# Altium schematic sheet esp32.SchDoc
size A4; SheetNumber: 1; SheetTotal: 1
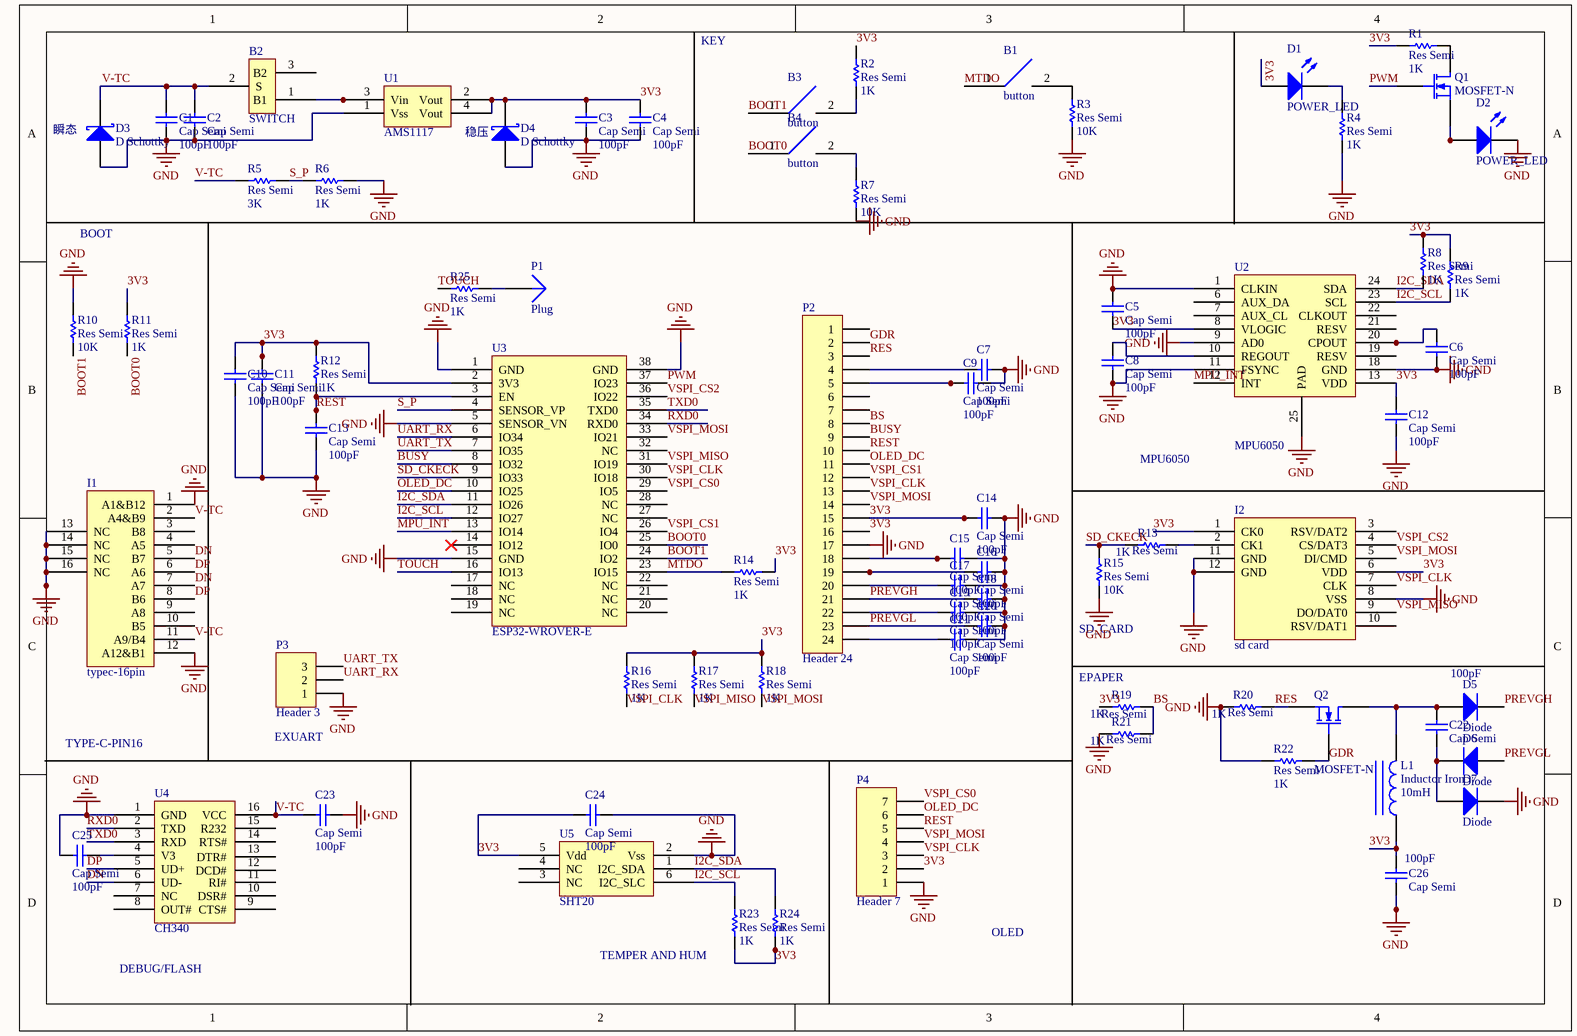
[diagram p0: esp32.SchDoc]

## Parts
B1  button  [BUTTON-BODY(3x6x2.5)]
B2  SWITCH  [switch-3]
B3  button  [BUTTON-BODY(3x6x2.5)]
B4  button  [BUTTON-BODY(3x6x2.5)]
C1  Cap Semi  value 100pF  [1608[0603]]
C2  Cap Semi  value 100pF  [1608[0603]]
C3  Cap Semi  value 100pF  [1608[0603]]
C4  Cap Semi  value 100pF  [1608[0603]]
C5  Cap Semi  value 100pF  [1608[0603]]
C6  Cap Semi  value 100pF  [1608[0603]]
C7  Cap Semi  value 100pF  [1608[0603]]
C8  Cap Semi  value 100pF  [1608[0603]]
C9  Cap Semi  value 100pF  [1608[0603]]
C10  Cap Semi  value 100pF  [1608[0603]]
C11  Cap Semi  value 100pF  [1608[0603]]
C12  Cap Semi  value 100pF  [1608[0603]]
C13  Cap Semi  value 100pF  [1608[0603]]
C14  Cap Semi  value 100pF  [1608[0603]]
C15  Cap Semi  value 100pF  [1608[0603]]
C16  Cap Semi  value 100pF  [1608[0603]]
C17  Cap Semi  value 100pF  [1608[0603]]
C18  Cap Semi  value 100pF  [1608[0603]]
C19  Cap Semi  value 100pF  [1608[0603]]
C20  Cap Semi  value 100pF  [1608[0603]]
C21  Cap Semi  value 100pF  [1608[0603]]
C22  Cap Semi  value 100pF  [1608[0603]]
C23  Cap Semi  value 100pF  [1608[0603]]
C24  Cap Semi  value 100pF  [1608[0603]]
C25  Cap Semi  value 100pF  [1608[0603]]
C26  Cap Semi  value 100pF  [1608[0603]]
D1  POWER_LED  [6-0805_M]
D2  POWER_LED  [6-0805_M]
D3  D Schottky  [TVS-BODY(4.5x3.5)]
D4  D Schottky  [Diode-body(5x2.45)]
D5  Diode  [INDC4532]
D6  Diode  [1812]
D7  Diode  [1812]
I1  typec-16pin  [Type-C-16PIN]
I2  sd card  [TF-Card]
L1  Inductor Iron  value 10mH  [1812]
P1  Plug  [PIN1]
P2  Header 24  [Connector-FPC-0.5*24]
P3  Header 3  [Connector-3.5x3]
P4  Header 7  [HDR1X7]
Q1  MOSFET-N  [SOT23_L]
Q2  MOSFET-N  [SOT23_L]
R1  Res Semi  value 1K  [1608[0603]]
R2  Res Semi  value 1K  [1608[0603]]
R3  Res Semi  value 10K  [1608[0603]]
R4  Res Semi  value 1K  [1608[0603]]
R5  Res Semi  value 3K  [1608[0603]]
R6  Res Semi  value 1K  [1608[0603]]
R7  Res Semi  value 10K  [1608[0603]]
R8  Res Semi  value 1K  [1608[0603]]
R9  Res Semi  value 1K  [1608[0603]]
R10  Res Semi  value 10K  [1608[0603]]
R11  Res Semi  value 1K  [1608[0603]]
R12  Res Semi  value 1K  [1608[0603]]
R13  Res Semi  value 1K  [1608[0603]]
R14  Res Semi  value 1K  [1608[0603]]
R15  Res Semi  value 10K  [1608[0603]]
R16  Res Semi  value 1K  [1608[0603]]
R17  Res Semi  value 1K  [1608[0603]]
R18  Res Semi  value 1K  [1608[0603]]
R19  Res Semi  value 1K  [1608[0603]]
R20  Res Semi  value 1K  [1608[0603]]
R21  Res Semi  value 1K  [1608[0603]]
R22  Res Semi  value 1K  [1608[0603]]
R23  Res Semi  value 1K  [1608[0603]]
R24  Res Semi  value 1K  [1608[0603]]
R25  Res Semi  value 1K  [1608[0603]]
U1  AMS1117  [SOT223_M]
U2  MPU6050  [MPU6050]
U3  ESP32-WROVER-E  [ESP32-WROVER-E]
U4  CH340  [SOP16-SOP127P650X265-16N]
U5  SHT20  [SHT20]

## Nets
GND: C1.1 C2.1 C3.1 C4.1 C5.2 C6.1 C7.1 C8.1 C9.1 C10.1 C11.1 C12.1 C13.1 C14.1 C15.1 C16.1 C17.1 C18.1 C19.1 C20.1 C21.1 C23.1 C24.1 C25.2 C26.1 D2.2(K) D3.1(A) D4.1(A) D7.2(K) I1.1(A1&B12) I1.12(A12&B1) I1.13(NC) I1.14(NC) I1.15(NC) I1.16(NC) I2.8(VSS) I2.11(GND) I2.12(GND) P2.17 P3.1 P4.1 R3.2 R4.2 R6.2 R7.2 R10.1 R15.1 R20.1 R21.1 R22.1 U1.1(Vss) U2.1(CLKIN) U2.9(AD0) U2.11(FSYNC) U2.18(GND) U2.25(PAD) U3.1(GND) U3.5(SENSOR_VN) U3.15(GND) U3.38(GND) U4.1(GND) U5.2(Vss)
3V3: C3.2 C4.2 C5.1 C10.2 C11.2 C12.2 C14.2 C24.2 C26.2 D1.1(A) D4.2(K) I2.1(CK0) I2.6(VDD) L1.1 P2.15 P2.16 P4.2 R1.1 R2.1 R8.1 R9.1 R11.1 R12.2 R14.2 R16.2 R17.2 R18.2 R19.1 R23.2 R24.2 U1.2(Vout) U1.4(Vout) U2.8(VLOGIC) U2.13(VDD) U3.2(3V3) U5.5(Vdd)
BOOT0: B4.1 R11.2 U3.25(IO0)
BOOT1: B3.1 R10.2 U3.24(IO2)
BS: P2.8 R19.2 R21.2
BUSY: P2.9 U3.8(IO32)
DN: I1.5(B7) I1.7(A7) U4.6(UD-)
DP: I1.6(A6) I1.8(B6) U4.5(UD+)
GDR: P2.2 Q2.2(G) R22.2
I2C_SCL: R9.2 R23.1 U2.23(SCL) U3.12(IO27) U5.6(I2C_SLC)
I2C_SDA: R8.2 R24.1 U2.24(SDA) U3.11(IO26) U5.1(I2C_SDA)
MPU_INT: U2.12(INT) U3.13(IO14)
MTDO: B1.1 R14.1 U3.23(IO15)
OLED_DC: P2.11 P4.6 U3.10(IO25)
PREVGH: C18.2 D5.2(K) P2.21
PREVGL: C20.2 D6.1(A) P2.23
PWM: Q1.2(G) U3.37(IO23)
RES: P2.3 Q2.3(S) R20.2
REST: C13.2 P2.10 P4.5 R12.1 U3.3(EN)
RXD0: U3.34(RXD0) U4.2(TXD)
S_P: R5.2 R6.1 U3.4(SENSOR_VP)
SD_CKECK: R13.1 R15.2 U3.9(IO33)
TOUCH: R25.1 U3.16(IO13)
TXD0: U3.35(TXD0) U4.3(RXD)
UART_RX: P3.2 U3.6(IO34)
UART_TX: P3.3 U3.7(IO35)
V-TC: B2.2(S) C1.2 C2.2 C23.2 D3.2(K) I1.2(A4&B9) I1.11(A9/B4) R5.1 U4.16(VCC)
VSPI_CLK: I2.7(CLK) P2.13 P4.3 R16.1 U3.30(IO18)
VSPI_CS0: P4.7 U3.29(IO5)
VSPI_CS1: P2.12 U3.26(IO4)
VSPI_CS2: I2.4(CS/DAT3) U3.36(IO22)
VSPI_MISO: I2.9(DO/DAT0) R17.1 U3.31(IO19)
VSPI_MOSI: I2.5(DI/CMD) P2.14 P4.4 R18.1 U3.33(IO21)
NetB1_2: B1.2 R3.1
NetB2_1: B2.1(B1) U1.3(Vin)
NetB3_2: B3.2 R2.2
NetB4_2: B4.2 R7.1
NetC6_2: C6.2 U2.20(CPOUT)
NetC7_2: C7.2 P2.4
NetC8_2: C8.2 U2.10(REGOUT)
NetC9_2: C9.2 P2.5
NetC15_2: C15.2 P2.18
NetC16_2: C16.2 P2.19
NetC17_2: C17.2 P2.20
NetC19_2: C19.2 P2.22
NetC21_2: C21.2 P2.24
NetC22_1: C22.1 D6.2(K) D7.1(A)
NetC22_2: C22.2 D5.1(A) L1.2 Q2.1(D)
NetC25_1: C25.1 U4.4(V3)
NetD1_2: D1.2(K) R4.1
NetD2_1: D2.1(A) Q1.3(S)
NetI2_2: I2.2(CK1) R13.2
NetP1_1: P1.1 R25.2
NetQ1_1: Q1.1(D) R1.2

Not connected (* = marked no-connect by the designer): B2 3(B2); I1 3(B8) 4(A5) 9(A8) 10(B5); I2 3(RSV/DAT2) 10(RSV/DAT1); P2 1 6 7; U2 2(NC) 3(NC) 4(NC) 5(NC) 6(AUX_DA) 7(AUX_CL) 14(NC) 15(NC) 16(NC) 17(NC) 19(RESV) 21(RESV) 22(CLKOUT); U3 14(IO12)* 17(NC) 18(NC) 19(NC) 20(NC) 21(NC) 22(NC) 27(NC) 28(NC) 32(NC); U4 7(NC) 8(OUT#) 9(CTS#) 10(DSR#) 11(RI#) 12(DCD#) 13(DTR#) 14(RTS#) 15(R232); U5 3(NC) 4(NC)

## Notes on the sheet
- KEY
- (near D3) 瞬态
- 稳压
- BOOT
- MPU6050
- (near R15) SD_CARD
- (near R19) EPAPER
- TYPE-C-PIN16
- (near P3) EXUART
- DEBUG/FLASH
- TEMPER AND HUM
- OLED

## Library data of the parts
B1 B3 B4 = button-switch-2
B2 = button-switch-3
C1-C26 = Cap Semi: Capacitor (Semiconductor SIM Model); Published: 8-Jun-2000; LatestRevisionDate: 29-May-2009; LatestRevisionNote: IPC-7351 Footprint Added.; PackageReference: C1206; Publisher: Altium Limited; PackageDescription: Chip Capacitor
D1 D2 = LED3: Typical BLUE SiC LED; Published: 8-Jun-2000; LatestRevisionDate: 17-Dec-2003; LatestRevisionNote: PCB Footprint replaced.; DatasheetVersion: 16-Apr-2002; PackageVersion: 16-Apr-2002; PackageReference: 3.5X2.8X1.9; Publisher: Altium Limited; PackageDescription: SM LED; 2 C-Bend Leads; Body 3.5 x 2.8 x 1.9 mm, inc leads (LxWxH typ)
D3 D4 = D Schottky: Schottky Diode; Published: 8-Jun-2000; LatestRevisionDate: 17-Jul-2002; LatestRevisionNote: Re-released for DXP Platform.; PackageReference: SMB; Publisher: Altium Limited; PackageDescription: DO-214-AA/SMB; 2 C-Bend Leads; Body 5.3 x 3.6 mm, inc. leads (LxW); Code_JEDEC: DO-214-AA
D5-D7 = Diode: Default Diode; Published: 8-Jun-2000; LatestRevisionDate: 17-Jul-2002; LatestRevisionNote: Re-released for DXP Platform.; PackageVersion: Sep-1996; PackageReference: SMC; Publisher: Altium Limited; PackageDescription: DO-214-AB/SMC; 2 C-Bend Leads; Body 7.9 x 5.9 mm, inc. leads (LxW); Code_JEDEC: DO-214-AB
I2 = sd card-10pin
L1 = Inductor Iron: Magnetic-Core Inductor; Published: 24-Mar-1999; LatestRevisionDate: 17-Jul-2002; LatestRevisionNote: Re-released for DXP Platform.; PackageReference: AXIAL-0.9; Publisher: Altium Limited; PackageDescription: Axial Device, Thru-Hole; 2 Leads; 0.9 in Pin Spacing
P2 = Header 24: Header, 24-Pin; LatestRevisionDate: 17-Jul-2002; LatestRevisionNote: Re-released for DXP Platform.; Publisher: Altium Limited
P3 = Header 3: Header, 3-Pin; LatestRevisionDate: 17-Jul-2002; LatestRevisionNote: Re-released for DXP Platform.; Publisher: Altium Limited
P4 = Header 7: Header, 7-Pin; LatestRevisionDate: 17-Jul-2002; LatestRevisionNote: Re-released for DXP Platform.; Publisher: Altium Limited
Q1 Q2 = MOSFET-N: N-Channel MOSFET; Published: 8-Jun-2000; LatestRevisionDate: 17-Jul-2002; LatestRevisionNote: Re-released for DXP Platform.; PackageVersion: 1995/1996; PackageReference: E3; Publisher: Altium Limited; PackageDescription: TO, Flat Index; 3 In-Line, Axial Leads; Body Dia. 4.6mm; Lead Dia. 0.5 mm (max)
R1-R25 = Res Semi: Semiconductor Resistor; Published: 8-Jun-2000; LatestRevisionDate: 17-Jul-2002; LatestRevisionNote: Re-released for DXP Platform.; PackageReference: AXIAL-0.5; Publisher: Altium Limited; PackageDescription: Axial Device, Thru-Hole; 2 Leads; 0.5 in Pin Spacing
U4 = CH340C
U5 = SHT20: sensor for the temperature and humidity
P1 = Plug: LatestRevisionDate: 17-Jul-2002; LatestRevisionNote: Re-released for DXP Platform.; Publisher: Altium Limited